# EAGLE design board (EAGLE 8.7.0)
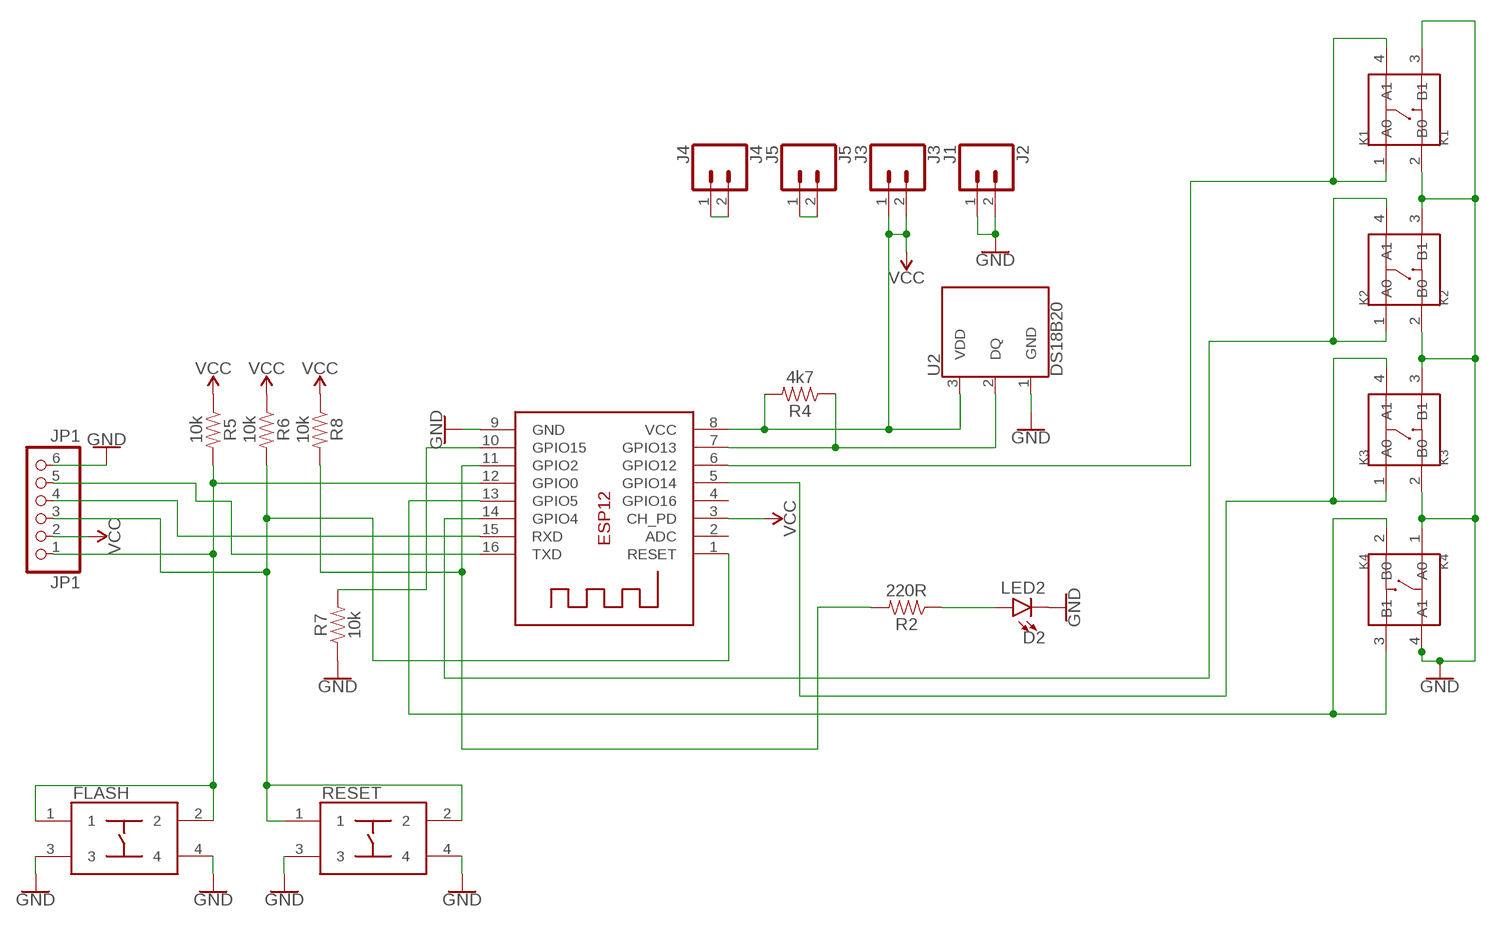
[diagram p0: schematic, sheet 1]

## Parts
D2  LED2  LED3MM  [LED_3MM]
ESP  ESP  ESP-12  [ESP-12]
FLASH  TACTILE_SWITCH_DEV  [TACTEIL_SWITCH_PAC]
J2  J1  CONN_02  [1X02]
J3  J3  CONN_02  [1X02]
J4  J4  CONN_02  [1X02]
J5  J5  CONN_02  [1X02]
JP1  JP1  PINHD-1X6  [1X06]
K1  K1  SMD-SWITCH-TACTILE-SPST-NO(4P-D6.0MM)  [SW4-SMD-6.0X6.0X5.0MM]
K2  K2  SMD-SWITCH-TACTILE-SPST-NO(4P-D6.0MM)  [SW4-SMD-6.0X6.0X5.0MM]
K3  K3  SMD-SWITCH-TACTILE-SPST-NO(4P-D6.0MM)  [SW4-SMD-6.0X6.0X5.0MM]
K4  K4  SMD-SWITCH-TACTILE-SPST-NO(4P-D6.0MM)  [SW4-SMD-6.0X6.0X5.0MM]
R2  220R  1KOHM-0603-1/10W-1%  [0603]
R4  4k7  1KOHM-0603-1/10W-1%  [0603]
R5  10k  1KOHM-0603-1/10W-1%  [0603]
R6  10k  1KOHM-0603-1/10W-1%  [0603]
R7  10k  1KOHM-0603-1/10W-1%  [0603]
R8  10k  1KOHM-0603-1/10W-1%  [0603]
RESET  TACTILE_SWITCH_DEV  [TACTEIL_SWITCH_PAC]
U2  DS18B20  [TO-92-AMMO]

## Nets
GND: D2.K(C) ESP.9(GND) FLASH.3 FLASH.4 J2.1 J2.2 JP1.6 K1.2(B0) K1.3(B1) K2.2(B0) K2.3(B1) K3.2(B0) K3.3(B1) K4.1(A0) K4.4(A1) R7.1 RESET.3 RESET.4 U2.1(GND)
N$1: ESP.10(GPIO15) R7.2
N$2: D2.A R2.1
N$3: ESP.16(TXD) JP1.5
N$5: ESP.13(GPIO5) K4.2(B0) K4.3(B1)
N$6: ESP.6(GPIO12) K1.1(A0) K1.4(A1)
N$8: ESP.15(RXD) JP1.4
N$9: J4.1 J4.2
N$10: ESP.12(GPIO0) FLASH.1 FLASH.2 JP1.1 R5.2
N$11: ESP.14(GPIO4) K2.1(A0) K2.4(A1)
N$12: ESP.5(GPIO14) K3.1(A0) K3.4(A1)
N$14: J5.1 J5.2
N$15: ESP.1(RESET) JP1.3 R6.2 RESET.1 RESET.2
N$18: ESP.7(GPIO13) R4.1 U2.2(DQ)
N$21: ESP.11(GPIO2) R2.2 R8.2
VCC: ESP.3(CH_PD) ESP.8(VCC) J3.1 J3.2 JP1.2 R4.2 R5.1 R6.1 R8.1 U2.3(VDD)
Unconnected: ESP.2(ADC) ESP.4(GPIO16)

## Library data of the parts
D2 = SparkFun-LED:LED: LED (Generic) Standard schematic elements and footprints for 5mm, 3mm, 1206, and 0603 sized LEDs. Generic LEDs with no color specified.; PROD_ID: DIO-08794
ESP = adafruit:ESP-12
FLASH RESET = Tactaile:TACTILE_SWITCH_DEV
J2-J5 = SparkFun-Connectors:CONN_02: Multi connection point. Often used as Generic Header-pin footprint for 0.1 inch spaced/style header connections On any of the 0.1 inch spaced packages, you can populate with these: Break Away Headers - Straight <https://www.sparkfun.com/products/116> (PRT-00116) Break Away Male Headers - Right Angle <https://www.sparkfun.com/products/553> (PRT-00553) Female Headers <https://www.sparkfun.com/products/115> (PRT-00115) Break Away Headers - Machine Pin <https://www.sparkfun.com/products/117> (PRT-00117) Break Away Female Headers - Swiss Machine Pin <https://www.sparkfun.com/products/743> (PRT-00743) For SCREWTERMINALS and SPRING TERMINALS visit here: Screw Terimnals on SparkFun.com <https://www.sparkfun.com/search/results?term=Screw+Terminals> (5mm/3.5mm/2.54mm spacing) This device is also useful as a general connection point to wire up your design to another part of your project. Our various solder wires solder well into these plated through hole pads. Hook-Up Wire - Assortment (Stranded, 22 AWG) <https://www.sparkfun.com/products/11375> (PRT-11375) Hook-Up Wire - Assortment (Solid Core, 22 AWG) <https://www.sparkfun.com/products/11367> (PRT-11367) View the entire wire category on our website here <https://www.sparkfun.com/categories/141> Special notes: Molex polarized connector foot print use with: PRT-08233 with associated crimp pins and housings. 2.54_SCREWTERM for use with PRT-10571. 3.5mm Screw Terminal footprints for PRT-08084 5mm Screw Terminal footprints for use with PRT-08432
JP1 = pinhead:PINHD-1X6: PIN HEADER
K1-K4 = Seeed-Switch:SMD-SWITCH-TACTILE-SPST-NO(4P-D6.0MM): 311020004; MPN: DTSM-62K-S-V-T/R(SN431)
R2 R4-R8 = SparkFun-Resistors:1KOHM: 1kΩ resistor A resistor is a passive two-terminal electrical component that implements electrical resistance as a circuit element. Resistors act to reduce current flow, and, at the same time, act to lower voltage levels within circuits. - Wikipedia; PROD_ID: RES-07856; VALUE: 1k
U2 = SparkFun-Sensors:DS18B20: Dallas/Maxim DS18B20 1-Wire Temperature Sensor The DS18B20 reports degrees C with 9 to 12-bit precision, -55C to 125C (+/-0.5C). Each sensor has a unique 64-Bit Serial number etched into it - allows for a huge number of sensors to be used on one data bus. Datasheet <http://datasheets.maximintegrated.com/en/ds/DS18B20.pdf> SparkFun Products One Wire Digital Temperature Sensor - DS18B20 <https://www.sparkfun.com/products/245> (SEN-00245); STORE_ID: SEN-00245

## Board
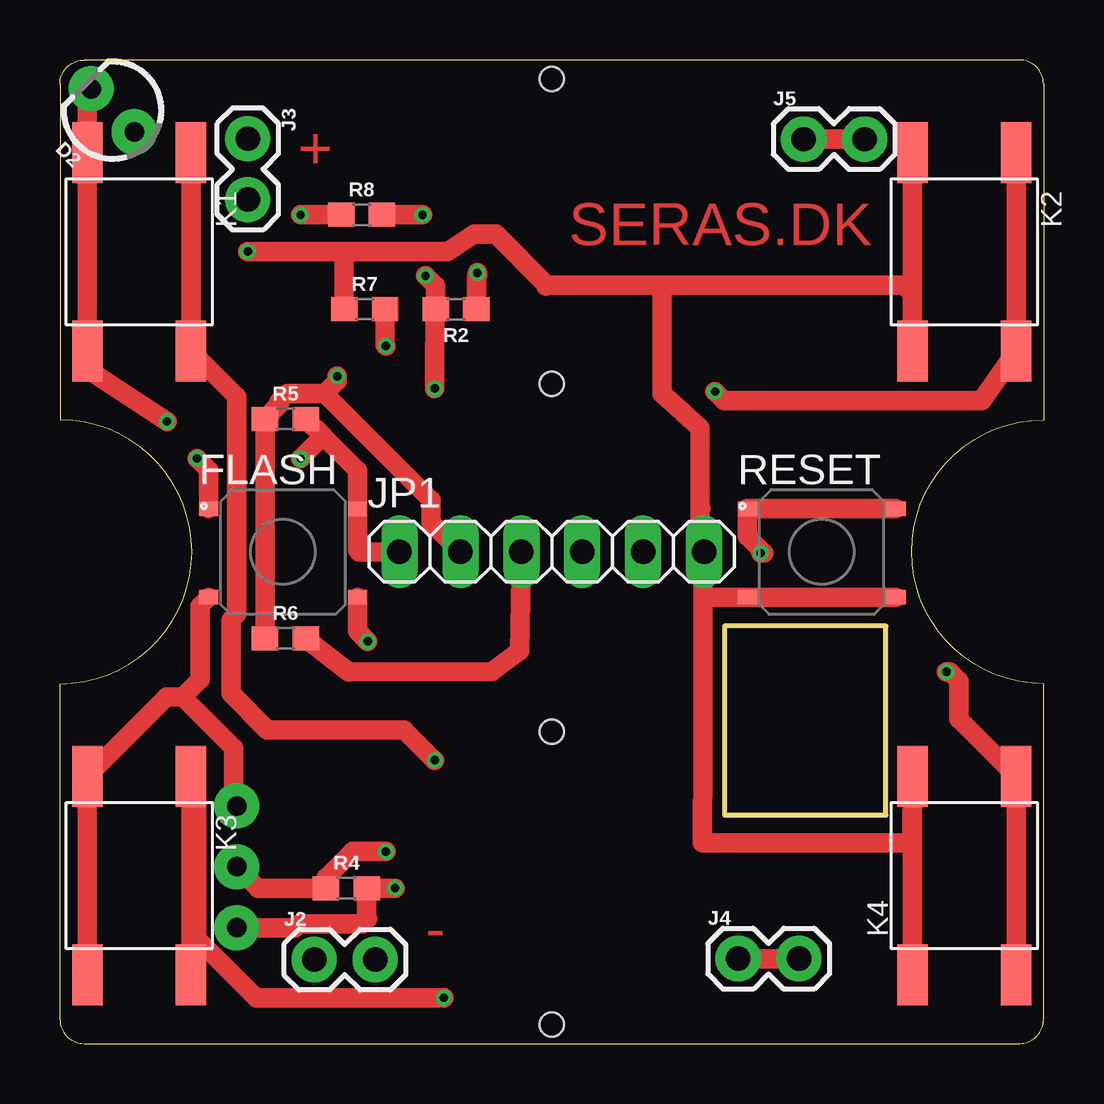
[diagram p1: board, top side]
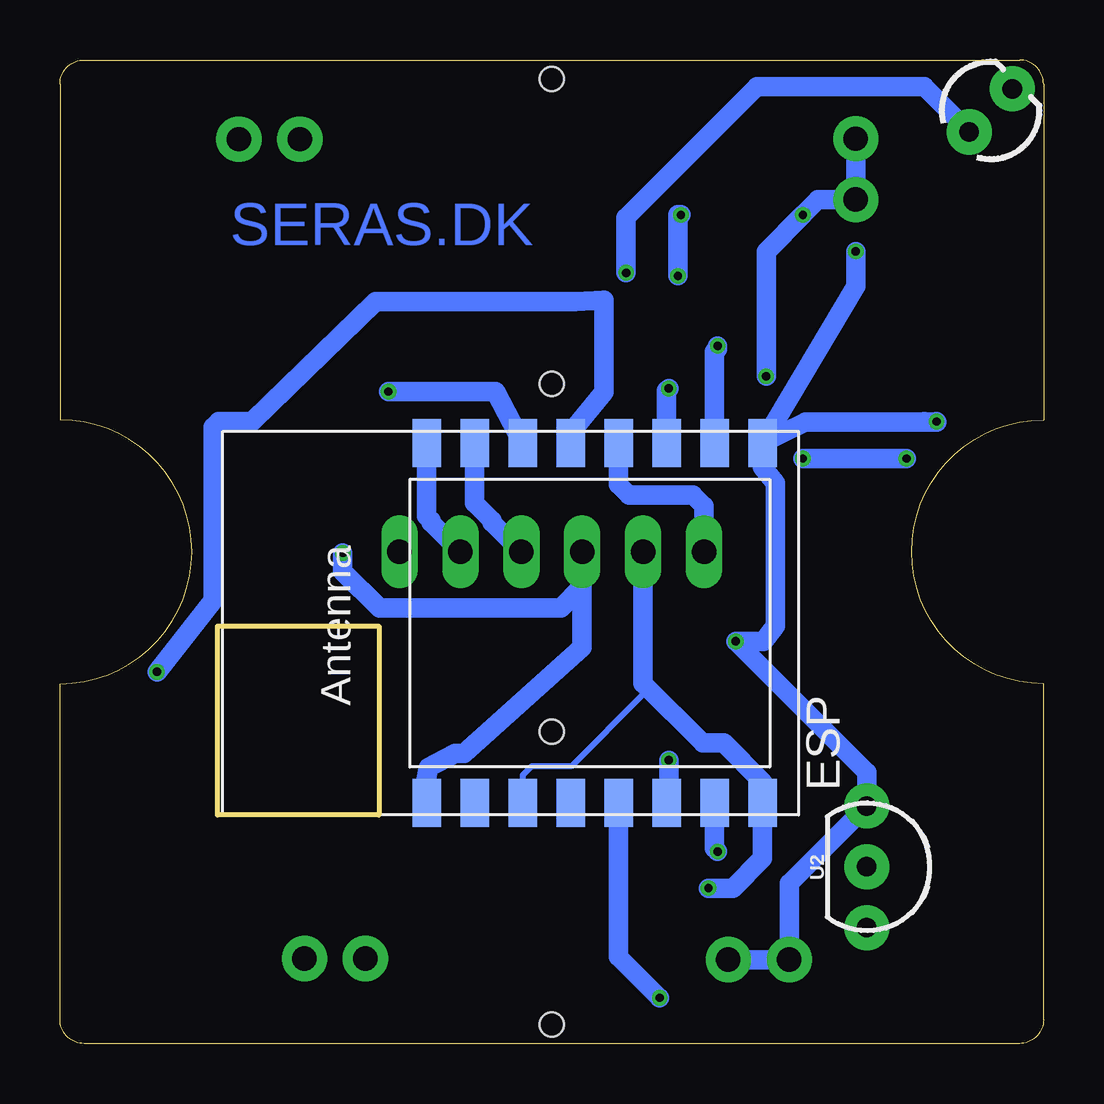
[diagram p2: board, bottom side, seen from below]

Size 41 x 41 mm. Coordinates in mm from the lower left corner, seen from the top.
Outline: 1,0 40,0 arc90 41,1 41,15 arc-90 35.5,20.5 arc-90 41,26 41,40 arc90 40,41 1,41 arc90 0,40 0,26 arc-90 5.5,20.5 arc-90 0,15 0,1 arc90 1,0
Copper layers (1*16): Top 0.035mm / dielectric 1.5mm / Bottom 0.035mm
Design rules "Itead": minimum track width 6mil, minimum drill 12mil, track to track 6mil, track to pad 6mil, pad to pad 6mil, via to via 6mil, smd to smd 0mil, copper to edge 10mil, drill to drill 10mil, minimum pad ring 10mil, minimum via ring 6mil, stop-mask expansion 2mil, vias tented up to drill 100mil, thermal gap 10mil
Holes 1 mm at 20.5,27.5 20.5,0.8 20.5,13 20.5,40.2
Milling: 4 lines

### Footprints (pad centres in the part's own frame; a part is rotated, then mirrored left to right if it is on the bottom)
LED_3MM = drill 0.813 pad 1.88: A -1.27,0; K 1.27,0
ESP-12 = smd 2 x 1.2: 1 -7.5,4.5; 2 -7.5,2.5; 3 -7.5,0.5; 4 -7.5,-1.5; 5 -7.5,-3.5; 6 -7.5,-5.5; 7 -7.5,-7.5; 8 -7.5,-9.5; 9 7.5,-9.5; 10 7.5,-7.5; 11 7.5,-5.5; 12 7.5,-3.5; 13 7.5,-1.5; 14 7.5,0.5; 15 7.5,2.5; 16 7.5,4.5
TACTEIL_SWITCH_PAC = smd 0.8 x 0.6: 1 -3.1,1.8; 2 3.1,1.8; 3 -3.1,-1.9; 4 3.1,-1.9
1X02 = drill 1.016 pad 1.88: 1 0,0; 2 2.54,0
1X06 = drill 1.016 long: 1 -6.35,0; 2 -3.81,0; 3 -1.27,0; 4 1.27,0; 5 3.81,0; 6 6.35,0
SW4-SMD-6.0X6.0X5.0MM = smd 2.54 x 1.27: 1 -4.129,2.159; 2 -4.129,-2.159; 3 4.129,-2.159; 4 4.129,2.159
0603 = smd 1.1 x 1: 1 -0.85,0; 2 0.85,0
TO-92-AMMO = drill 0.813 pad 1.88: 1 -2.54,0; 2 0,0; 3 2.54,0

### Placement (x,y rotation side)
D2  2.2,38.9 135 top
ESP  21.21,17.53 90 bottom
FLASH  9.3,20.5 0 top
J2  10.6,3.5 0 top
J3  7.83,37.72 270 top
J4  28.27,3.54 0 top
J5  31,37.7 0 top
JP1  20.5,20.5 0 top
K1  3.3,33 270 top
K2  37.7,33 270 top
K3  3.3,7 270 top
K4  37.7,7 90 top
R2  16.51,30.61 180 top
R4  11.94,6.48 0 top
R5  9.4,26.04 0 top
R6  9.4,16.89 0 top
R7  12.7,30.61 0 top
R8  12.57,34.54 0 top
RESET  31.75,20.5 0 top
U2  7.37,7.37 270 bottom

### Tracks (layer width: path | path; a pad name or v marks a point on that pad's centre or on a via)
GND  (via drill 0.35)
  Top 0.813: K4.1 K4.4 35.52,8.36 26.79,8.36 26.8,12.03 26.8,18.54 | K3.3 K3.2 4.46,14.45 5.11,14.45 | K2.3 35.54,31.24 | 35.54,31.24 K2.2 | v4.46,25.93 1.14,28.1 K1.3 K1.2 1.14,39.64 D2.K | 26.8,18.54 26.8,19.87 | 26.8,19.87 26.67,20 | 26.67,22.35 26.67,25.65 25.49,26.74 25.09,27.1 25.09,31.57 25.15,31.62 | 26.72,22.3 26.67,22.35 | 26.8,18.54 26.86,18.6 RESET.3 RESET.4 | 26.8,19.87 26.8,20.45 JP1.6 26.67,20.68 26.67,22.35 | 20.29,31.62 24.36,31.62 | 24.36,31.62 20.32,31.59 20.27,31.64 | 20.27,31.64 18.18,33.73 17.25,33.73 16.16,33.02 11.68,33.02 | 20.27,31.58 20.27,31.64 | 11.68,33.02 v7.83,33.02 | R7.1 11.85,32.98 11.68,33.02 | U2.1 7.24,10.03 7.24,12.32 5.11,14.45 | FLASH.3 5.84,18.24 5.84,15.18 5.11,14.45 | FLASH.4 12.4,17.19 v12.83,16.76 | 24.36,31.62 25.15,31.62 | 35.54,31.24 35.16,31.62 25.15,31.62
  Bottom 0.813: ESP.9 9.92,25.91 4.45,25.91 | 4.45,25.91 4.97,25.93 | 4.45,25.91 v4.46,25.93 | v7.83,33.02 7.83,31.58 ESP.9 | J2.2 J2.1 10.6,6.67 U2.1 7.37,11.3 v12.83,16.76 11.68,16.76 11.18,17.4 11.18,23.37 11.71,24.03 ESP.9
N$1  (via drill 0.35)
  Top 0.813: v13.59,29.08 13.55,29.12 R7.2
  Bottom 0.813: ESP.10 13.71,28.84 13.59,28.96 v13.59,29.08
N$2  (via drill 0.35)
  Top 0.813: R2.1 17.36,31.96 17.4,32 v17.4,32.13
  Bottom 0.813: v17.4,32.13 17.4,34.42 11.94,39.88 4.97,39.88 D2.A
N$3
  Bottom 0.813: ESP.16 25.71,21.99 25.53,21.81 25.53,21.72 JP1.5
N$5  (via drill 0.35)
  Top 0.813: K4.2 K4.3 37.47,13.52 37.47,15.11 37.08,15.49 v36.96,15.49
  Bottom 0.813: v36.96,15.49 34.62,18.47 34.62,25.69 34.38,25.93 32.98,25.93 27.85,30.94 19.54,30.94 18.32,30.99 18.32,27.15 19.58,25.64 ESP.13
N$6  (via drill 0.35)
  Top 0.813: K1.1 K1.4 7.37,26.96 7.37,22.99 7.37,17.91 7.13,17.67 7.13,14.59 8.64,13.08 14.35,13.08 v15.62,11.81
  Bottom 0.813: v15.62,11.81 15.62,10.11 ESP.6
N$8
  Bottom 0.813: ESP.15 23.71,22.53 22.99,21.81 22.99,21.72 JP1.4
N$9
  Top 0.813: J4.1 J4.2
N$10  (via drill 0.35)
  Top 0.813: R5.2 10.97,25.32 | 10.97,25.32 12.4,23.88 FLASH.2 12.4,20.57 12.47,20.5 JP1.1 | FLASH.1 6.2,23.9 v5.71,24.38 | v10.03,24.38 10.97,25.32
  Bottom 0.813: ESP.12 17.71,23.3 17.27,22.86 14.61,22.86 14.15,22.41 JP1.1 | v5.71,24.38 v10.03,24.38
N$11  (via drill 0.35)
  Top 0.813: K2.1 K2.4 38.42,26.8 27.69,26.8 v27.3,27.18
  Bottom 0.813: ESP.14 22.85,27.17 25.27,27.18 v27.3,27.18
N$12  (via drill 0.35)
  Top 0.813: K3.4 K3.1 5.69,10.9 5.69,4.38 8.17,1.91 v16,1.91
  Bottom 0.813: v16,1.91 17.71,3.61 ESP.5
N$14
  Top 0.813: J5.1 J5.2
N$15  (via drill 0.35)
  Top 0.813: JP1.3 19.15,16.36 18.01,15.51 12.03,15.49 R6.2 | RESET.2 RESET.1 28.65,21.13 29.34,20.45 v29.21,20.45
  Bottom 0.813: 19.23,19.05 19.23,16.5 24.15,12.09 24.54,12.09 25.63,11.51 25.76,10.87 ESP.1 | 19.23,19.05 JP1.3 | v29.21,20.45 29.21,19.68 27.69,18.16 20.12,18.16 19.23,19.05
N$18  (via drill 0.35)
  Top 0.813: U2.2 8.26,6.48 R4.1 11.09,6.9 12.19,8 v13.59,8
  Bottom 0.813: ESP.7 13.71,8.13 13.72,8.13 v13.59,8
N$21  (via drill 0.35)
  Top 0.813: v15.62,27.3 15.62,28.79 R2.2 15.66,31.58 v15.24,32 | v15.11,34.54 R8.2
  Bottom 0.813: ESP.11 15.71,27.22 v15.62,27.3 | v15.24,32 15.24,34.54 v15.11,34.54
VCC  (via drill 0.35)
  Top 0.813: R6.1 R5.1 9.14,26.63 9.14,26.77 9.47,27.09 11.03,27.09 | JP1.2 15.47,21.72 15.47,22.65 11.03,27.09 | 11.03,27.09 11.56,27.62 v11.56,27.81 | v10.03,34.54 R8.1 | U2.3 9.81,4.83 9.98,5 12.62,5 12.83,5.21 12.79,5.25 R4.2 v13.97,6.48
  Bottom 0.254: 16.69,15.01 16.69,14.55 19.68,11.56 21.34,11.56 21.71,11.18 ESP.3
  Bottom 0.813: JP1.2 16.69,15.01 14.21,12.52 13.32,12.52 11.71,10.91 ESP.8 11.71,7.72 12.95,6.48 v13.97,6.48 | v11.56,27.81 11.56,33.02 v10.03,34.54 9.4,35.18 J3.2 J3.1

### Text on the board
Top: + | SERAS.DK | -
Bottom: SERAS.DK